# Altium schematic sheet ICDI.SchDoc
size A; SheetNumber: 6; SheetTotal: 6
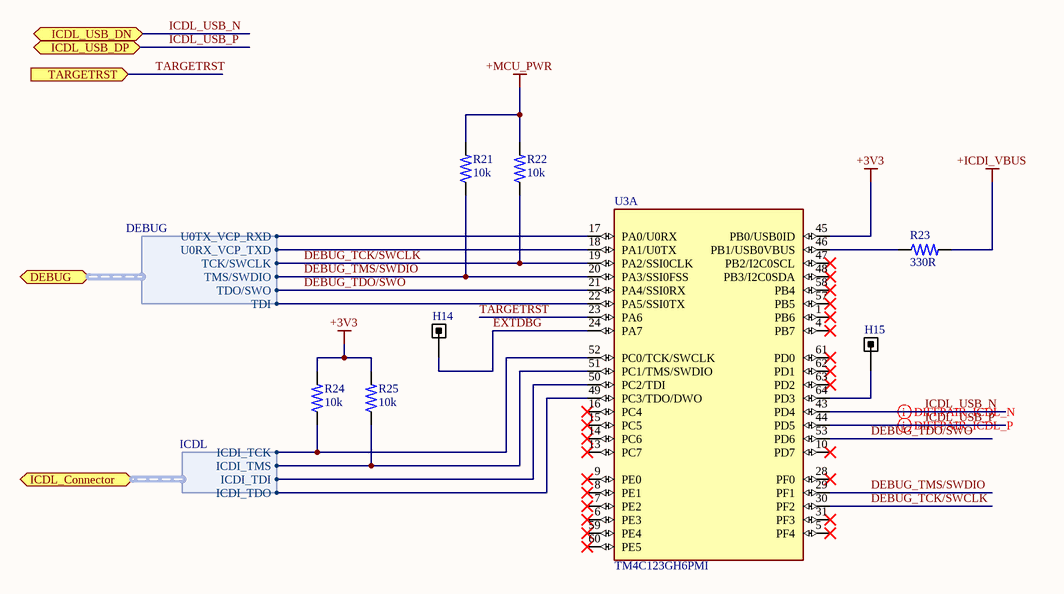
[diagram p0: ICDI.SchDoc]

## Parts
H14  Test Point  [Test Point]  (value not drawn)
H15  Test Point  [Test Point]  (value not drawn)
R21  10k  [0402 RES]
R22  10k  [0402 RES]
R23  330R  [0402 RES]
R24  10k  [0402 RES]
R25  10k  [0402 RES]
U3  TM4C123GH6PMI  [QFP50P1200X1200X160-64N]  (part A of 2)

## Ports
DEBUG (bidir, harness DEBUG, see Master[2B], Main_MCU[1B]), ICDL_Connector (bidir, harness ICDL, see Master[3B], Connectors[1B]), ICDL_USB_DN (bidir, see Master[3B], Connectors[1B]), ICDL_USB_DP (bidir, see Master[3B], Connectors[1B]), TARGETRST (in, see Master[3C], Connectors[6B], Powering[1B])

## Harnesses
DEBUG: U0RX_VCP_TXD, U0TX_VCP_RXD, TCK/SWCLK, TMS/SWDIO, TDI, TDO/SWO
ICDL: ICDI_TCK, ICDI_TMS, ICDI_TDI, ICDI_TDO

## Nets
+3V3: R24.2 R25.2 U3.45(PB0/USB0ID)
+ICDI_VBUS: R23.2
+MCU_PWR: R21.2 R22.2
DEBUG_TCK/SWCLK: R22.1 U3.19(PA2/SSI0CLK) U3.30(PF2) ; port DEBUG.TCK/SWCLK
DEBUG_TDO/SWO: U3.21(PA4/SSI0RX) U3.53(PD6) ; port DEBUG.TDO/SWO
DEBUG_TMS/SWDIO: R21.1 U3.20(PA3/SSI0FSS) U3.29(PF1) ; port DEBUG.TMS/SWDIO
EXTDBG: H14.1 U3.24(PA7)
ICDL_USB_N: U3.43(PD4) ; port ICDL_USB_DN
ICDL_USB_P: U3.44(PD5) ; port ICDL_USB_DP
TARGETRST: U3.23(PA6) ; port TARGETRST
NetH15_1: H15.1 U3.64(PD3)
NetR23_1: R23.1 U3.46(PB1/USB0VBUS)
NetR24_1: R24.1 U3.52(PC0/TCK/SWCLK) ; port ICDL_Connector.ICDI_TCK
NetR25_1: R25.1 U3.51(PC1/TMS/SWDIO) ; port ICDL_Connector.ICDI_TMS
NetU3_17: U3.17(PA0/U0RX) ; port DEBUG.U0TX_VCP_RXD
NetU3_18: U3.18(PA1/U0TX) ; port DEBUG.U0RX_VCP_TXD
NetU3_22: U3.22(PA5/SSI0TX) ; port DEBUG.TDI
NetU3_49: U3.49(PC3/TDO/DWO) ; port ICDL_Connector.ICDI_TDO
NetU3_50: U3.50(PC2/TDI) ; port ICDL_Connector.ICDI_TDI

Not connected (* = marked no-connect by the designer): U3 1(PB6)* 4(PB7)* 5(PF4)* 6(PE3)* 7(PE2)* 8(PE1)* 9(PE0)* 10(PD7)* 13(PC7)* 14(PC6)* 15(PC5)* 16(PC4)* 28(PF0)* 31(PF3)* 47(PB2/I2C0SCL)* 48(PB3/I2C0SDA)* 57(PB5)* 58(PB4)* 59(PE4)* 60(PE5)* 61(PD0)* 62(PD1)* 63(PD2)*

## Layout directives
differential pair; differential pair class USB: ICDL_USB_N, ICDL_USB_P

## Library data of the parts
R21 R22 R24 R25 = 0402 SMD Resistor: Fixed Resistor, Metal Glaze/thick Film, 0.0625W, 10000ohm, 50V, 1% +/-Tol, 100ppm/Cel, Surface Mount, 0402; Manufacturer: Yageo; Manufacturer Part Number: RC0402FR-0710KL; Additional Feature: LASER TRIMMABLE; Power: 62.5mW; Rated Temperature: 70°C; Value: 10kR; Temperature Coefficient: 100ppm/°C; Package Height: 0.35mm; Package Length: 1mm; Package Width: 0.5mm; ComponentLink1Description: Link; ComponentLink1URL: *; Supplier: Future Electronics; Supplier Part Number: 3388022; RoHS: Yes; Category: Chip SMD Resistors; Stock: 31210000; Pricing: 10000=0.0016, 100000=0.0015, 300000=0.0015, 1250000=0.0014, 3000000=0.0013 (USD); Mounting Technology: Surface Mount; Pins: 2; Package Shape: Rectangular; Case/Package: 0402; Terminal Finish: Nickel; Min Operating Temperature: -55°C; Max Operating Temperature: 155°C; JESD-609 Code: e3; Termination: Wraparound; Resistor Type: FIXED RESISTOR; Construction: Chip; Packaging: Tape and Reel; Technology: METAL GLAZE/THICK FILM; Working Voltage: 50V; Reach SVHC Compliant: Yes; RoHS Compliant: Yes; ComponentLink2URL: https://datasheet.ciiva.com:443/pdfs/VipMasterIC/IC/YAGO/YAGO-S-A0008145938/YAGO-S-A0008145938-1.pdf?src-supplier=IHS+Markit; ComponentLink2Description: https://datasheet.ciiva.com:443/pdfs/VipMasterIC/IC/YAGO/YAGO-S-A0008145938/YAGO-S-A0008145938-1.pdf?src-supplier=IHS+Markit
R23 = 0402 SMD Resistor: Fixed Resistor, Metal Glaze/thick Film, 0.125W, 330ohm, 75V, 1% +/-Tol, 100ppm/Cel, Surface Mount, 0402; Manufacturer: Vishay Dale; Manufacturer Part Number: RCC0402330RFKED; ComponentLink1Description: Link; ComponentLink1URL: *; Supplier: Digikey; Supplier Part Number: 541-RCC0402330RFKEDCT-ND; RoHS: Yes; Category: Chip SMD Resistors; Stock: 92625; Pricing: 1=0.1, 10=0.046, 50=0.0296, 100=0.0248, 500=0.01724, 1000=0.01499, 5000=0.0113 (USD)
U3 = TM4C123GH6PMI: ARMÂ® CortexÂ®-M4F Tivaâ„¢ C Microcontroller IC 32-Bit 80MHz 256KB _256K x 8_ FLASH 64-LQFP _10x10_; MF: Texas Instruments; Price: None; Availability: Unavailable; SnapEDA_Link: https://www.snapeda.com/parts/TM4C123GH6PMI/Texas%20Instruments/view-part/557012/?ref=snap; Value: *; Package: LQFP-64 Texas Instruments; MP: TM4C123GH6PMI